# EAGLE design SNARF-Protoboard-v00 (EAGLE 5.11)
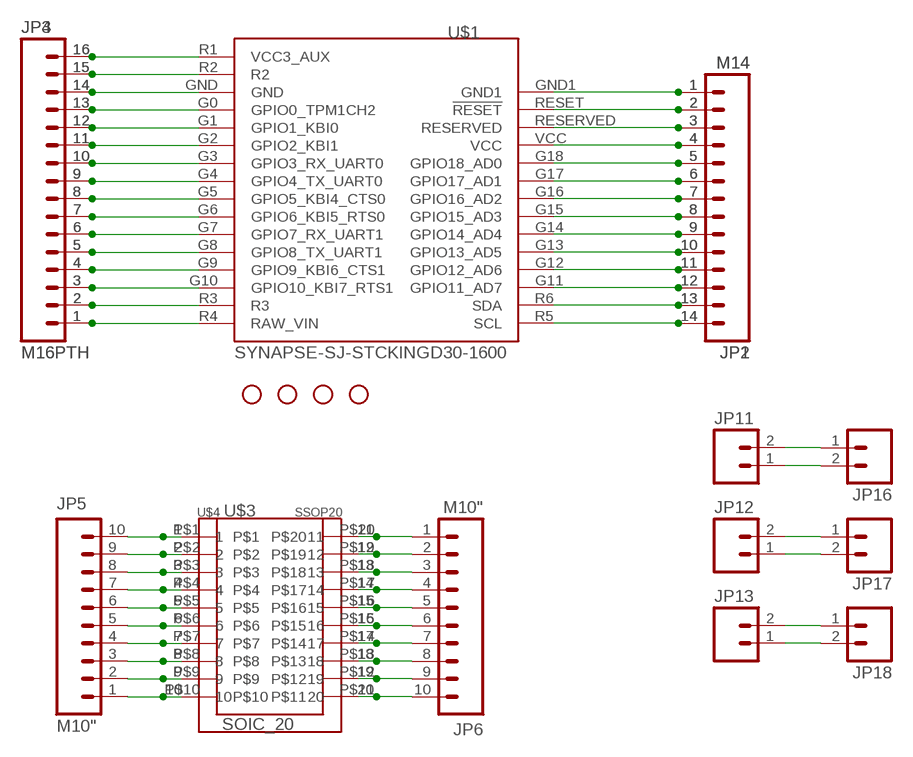
[diagram p0: schematic, sheet 1]

## Parts
JP1  M14  [1X14]
JP2  M14  [1X14]
JP3  M16PTH  [1X16]
JP4  M16PTH  [1X16]
JP5  M10"  [1X10]
JP6  M10"  [1X10]
JP7  STAND-OFF  [STAND-OFF]
JP8  STAND-OFF  [STAND-OFF]
JP9  STAND-OFF  [STAND-OFF]
JP10  STAND-OFF  [STAND-OFF]
JP11  M023.5MM  [SCREWTERMINAL-3.5MM-2]
JP12  M023.5MM  [SCREWTERMINAL-3.5MM-2]
JP13  M023.5MM  [SCREWTERMINAL-3.5MM-2]
JP16  M02PTH  [1X02]
JP17  M02PTH  [1X02]
JP18  M02PTH  [1X02]
U$1  SYNAPSE-SJ-STCKINGD30-1600  [SYNSJ-STACK]
U$3  SOIC_20  [SO20W]
U$4  SSOP20  [SSOP20-LONG]

## Nets
N$1 [bigsignal]: JP1.1 JP2.1 U$1.GND1
N$2 [bigsignal]: JP1.2 JP2.2 U$1.RESET(!RESET)
N$3 [bigsignal]: JP1.3 JP2.3 U$1.RESERVED
N$4 [bigsignal]: JP1.4 JP2.4 U$1.VCC
N$5 [bigsignal]: JP1.5 JP2.5 U$1.G18(GPIO18_AD0)
N$6 [bigsignal]: JP1.6 JP2.6 U$1.G17(GPIO17_AD1)
N$7 [bigsignal]: JP1.7 JP2.7 U$1.G16(GPIO16_AD2)
N$8 [bigsignal]: JP1.8 JP2.8 U$1.G15(GPIO15_AD3)
N$9 [bigsignal]: JP1.9 JP2.9 U$1.G14(GPIO14_AD4)
N$10 [bigsignal]: JP1.10 JP2.10 U$1.G13(GPIO13_AD5)
N$11 [bigsignal]: JP1.11 JP2.11 U$1.G12(GPIO12_AD6)
N$12 [bigsignal]: JP1.12 JP2.12 U$1.G11(GPIO11_AD7)
N$13 [bigsignal]: JP1.13 JP2.13 U$1.R6(SDA)
N$14 [bigsignal]: JP1.14 JP2.14 U$1.R5(SCL)
N$15 [bigsignal]: JP3.1 JP4.1 U$1.R4(RAW_VIN)
N$16 [bigsignal]: JP3.2 JP4.2 U$1.R3
N$17 [bigsignal]: JP3.3 JP4.3 U$1.G10(GPIO10_KBI7_RTS1)
N$18 [bigsignal]: JP3.4 JP4.4 U$1.G9(GPIO9_KBI6_CTS1)
N$19 [bigsignal]: JP3.5 JP4.5 U$1.G8(GPIO8_TX_UART1)
N$20 [bigsignal]: JP3.6 JP4.6 U$1.G7(GPIO7_RX_UART1)
N$21 [bigsignal]: JP3.7 JP4.7 U$1.G6(GPIO6_KBI5_RTS0)
N$22 [bigsignal]: JP3.8 JP4.8 U$1.G5(GPIO5_KBI4_CTS0)
N$23 [bigsignal]: JP3.9 JP4.9 U$1.G4(GPIO4_TX_UART0)
N$24 [bigsignal]: JP3.10 JP4.10 U$1.G3(GPIO3_RX_UART0)
N$25 [bigsignal]: JP3.11 JP4.11 U$1.G2(GPIO2_KBI1)
N$26 [bigsignal]: JP3.12 JP4.12 U$1.G1(GPIO1_KBI0)
N$27 [bigsignal]: JP3.13 JP4.13 U$1.G0(GPIO0_TPM1CH2)
N$28 [bigsignal]: JP3.14 JP4.14 U$1.GND
N$29 [bigsignal]: JP3.15 JP4.15 U$1.R2
N$30 [bigsignal]: JP3.16 JP4.16 U$1.R1(VCC3_AUX)
N$31: JP5.1 U$3.P$10 U$4.10
N$32: JP5.2 U$3.P$9 U$4.9
N$33: JP5.3 U$3.P$8 U$4.8
N$34: JP5.4 U$3.P$7 U$4.7
N$35: JP5.5 U$3.P$6 U$4.6
N$36: JP5.6 U$3.P$5 U$4.5
N$37: JP5.7 U$3.P$4 U$4.4
N$38: JP5.8 U$3.P$3 U$4.3
N$39: JP5.9 U$3.P$2 U$4.2
N$40: JP5.10 U$3.P$1 U$4.1
N$41: JP6.1 U$3.P$20 U$4.11
N$42: JP6.2 U$3.P$19 U$4.12
N$43: JP6.3 U$3.P$18 U$4.13
N$44: JP6.4 U$3.P$17 U$4.14
N$45: JP6.5 U$3.P$16 U$4.15
N$46: JP6.6 U$3.P$15 U$4.16
N$47: JP6.7 U$3.P$14 U$4.17
N$48: JP6.8 U$3.P$13 U$4.18
N$49: JP6.9 U$3.P$12 U$4.19
N$50: JP6.10 U$3.P$11 U$4.20
N$51: JP12.2 JP17.1
N$52: JP12.1 JP17.2
N$53: JP13.2 JP18.1
N$54: JP13.1 JP18.2
N$59: JP11.2 JP16.1
N$60: JP11.1 JP16.2

## Library data of the parts
JP1 JP2 = SparkFun:M14: Header 14 Standard 14-pin 0.1" header. Use with straight break away headers (SKU : PRT-00116), right angle break away headers (PRT-00553), swiss pins (PRT-00743), machine pins (PRT-00117), and female headers (PRT-00115).
JP3 JP4 = SparkFun:M16
JP5 JP6 = SparkFun:M10: Header 10 Standard 10-pin 0.1" header. Use with straight break away headers (SKU : PRT-00116), right angle break away headers (PRT-00553), swiss pins (PRT-00743), machine pins (PRT-00117), and female headers (PRT-00115).
JP7-JP10 = SparkFun:STAND-OFF: Stand Off This is the mechanical footprint for a #4 phillips button head screw. Use the keepout ring to avoid running the screw head into surrounding components. SKU : PRT-00447
JP11-JP13 JP16-JP18 = SparkFun:M02: Header 2 Standard 2-pin 0.1" header. Use with straight break away headers (SKU : PRT-00116), right angle break away headers (PRT-00553), swiss pins (PRT-00743), machine pins (PRT-00117), and female headers (PRT-00115). Molex polarized connector foot print use with SKU : PRT-08233 with associated crimp pins and housings.
U$1 = 0_jc-custom:SYNAPSE-SJ-STCKING: Standard layout for expansion modules using Synapse Wireless boards
U$3 = SparkFun:SOIC_20
U$4 = SparkFun:SSOP20

## Net classes
0 default: width 0.152 mm
1 bigsignal: width 0.508 mm

## Board
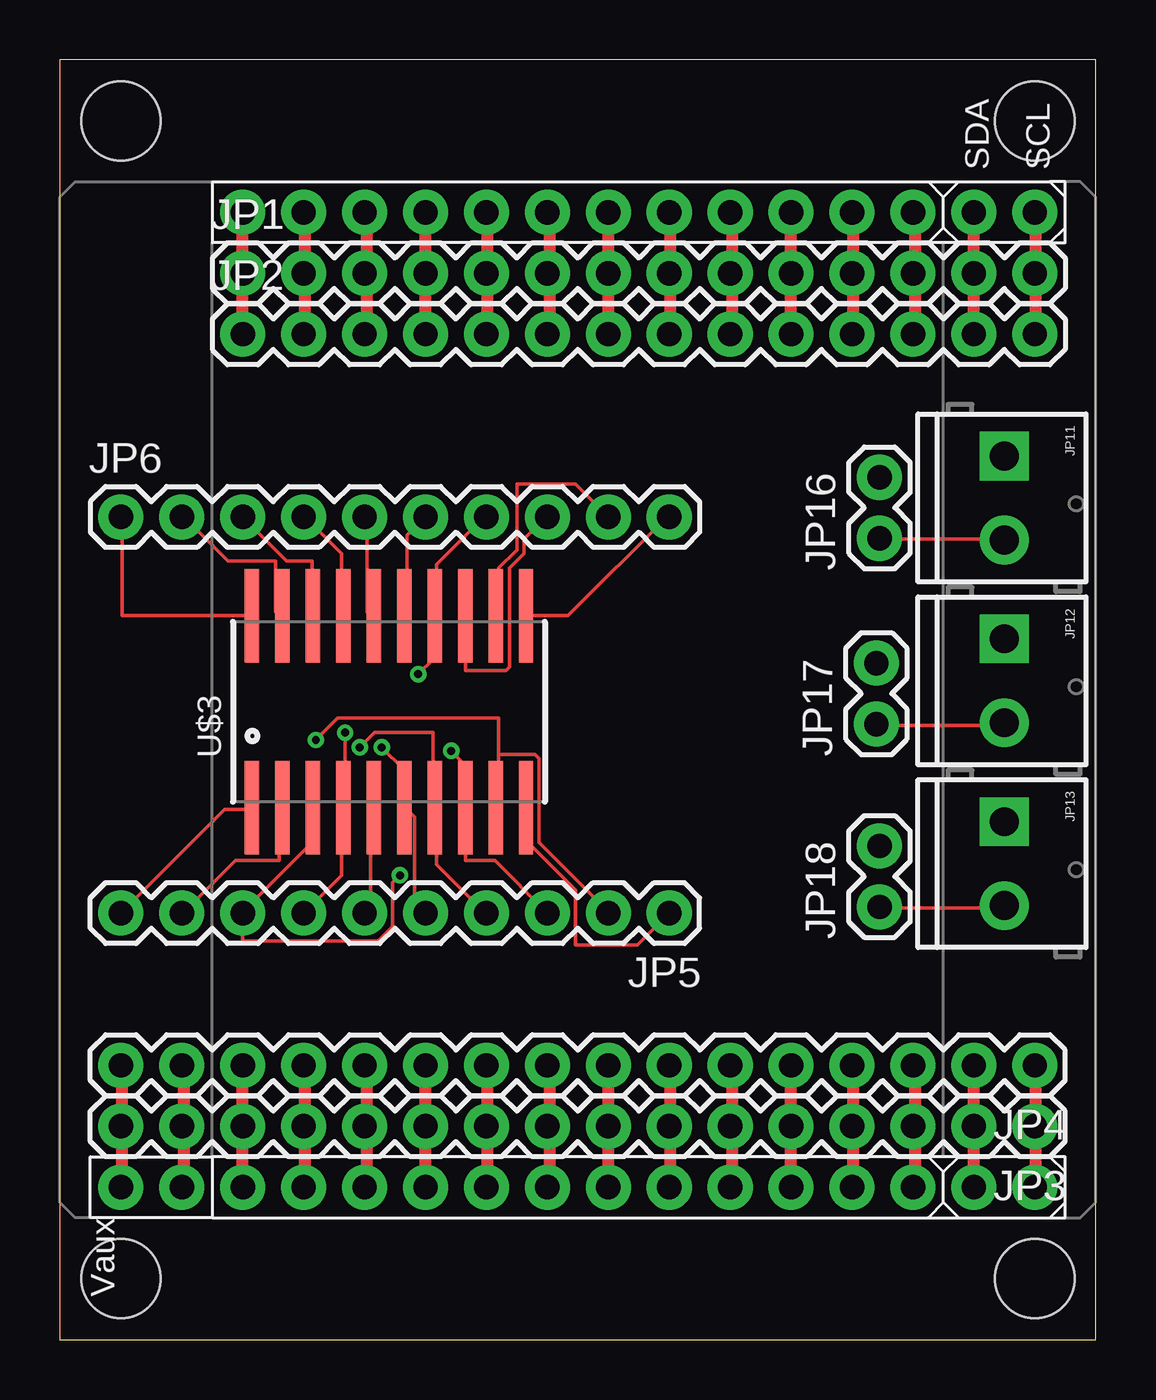
[diagram p1: board, top side]
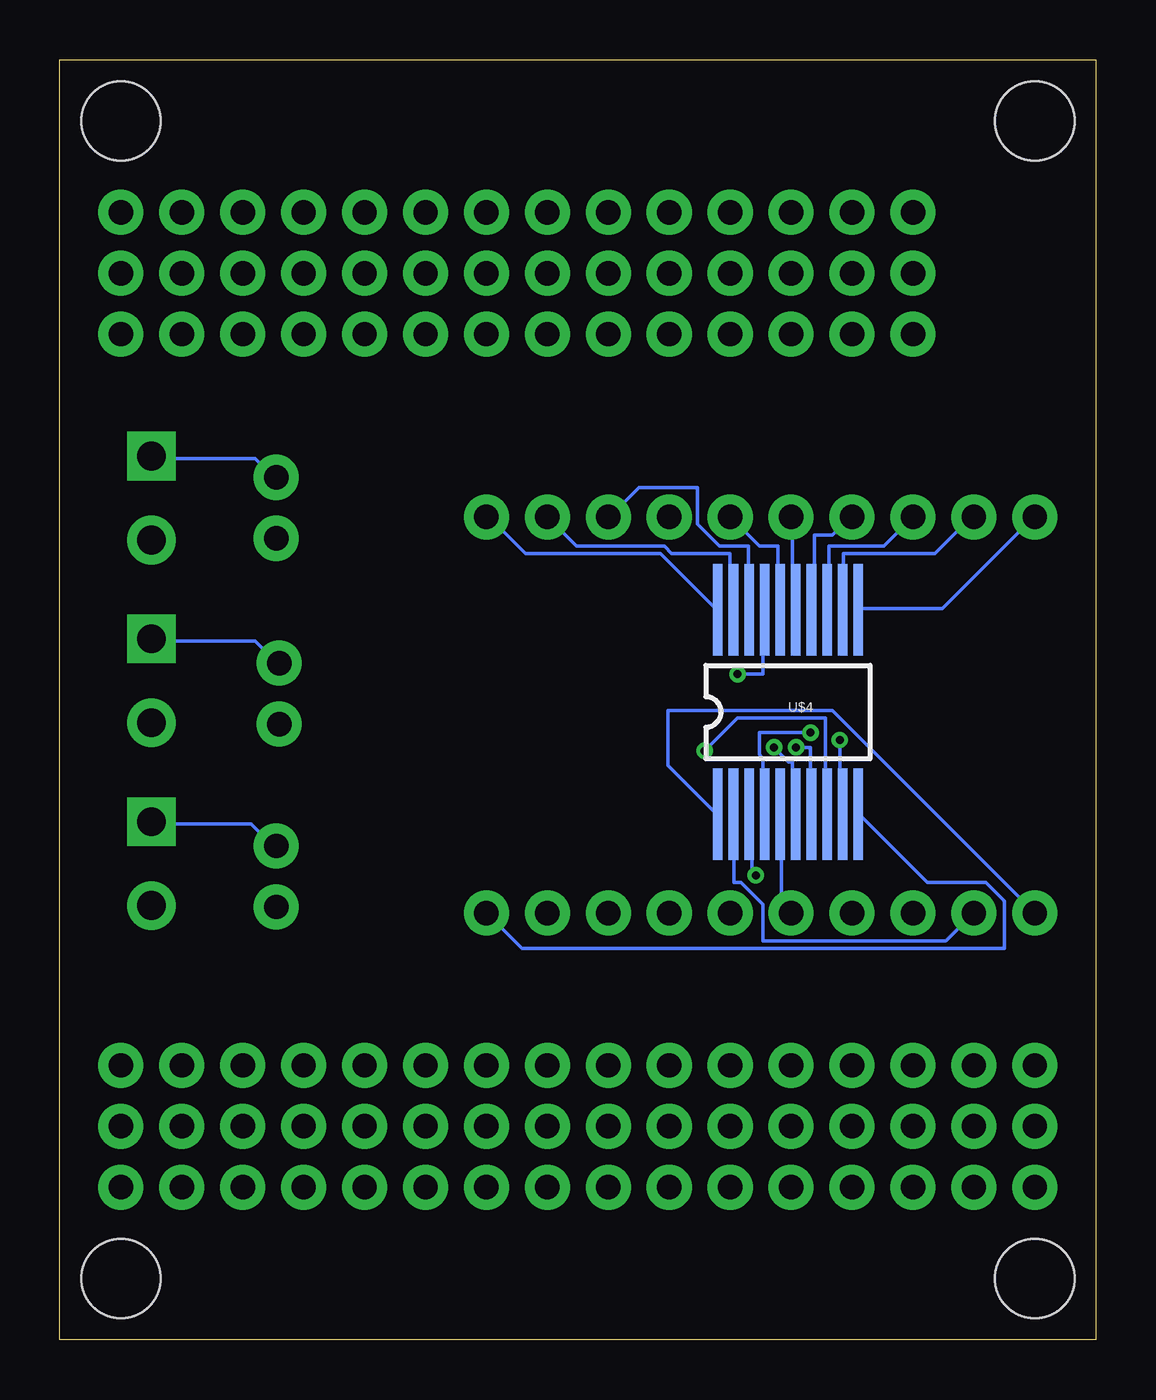
[diagram p2: board, bottom side, seen from below]

Size 43.18 x 53.34 mm. Coordinates in mm from the lower left corner, seen from the top.
Outline: 0,0 43.18,0 43.18,53.34 0,53.34 0,0
Copper layers (1*16): Top 0.0356mm / dielectric 1.5011mm / Bottom 0.0356mm
Design rules "LaenPCBOrder-JCModified": minimum track width 6mil, minimum drill 13mil, track to track 6mil, track to pad 6mil, pad to pad 6mil, via to via 6mil, smd to smd 6mil, copper to edge 15mil, drill to drill 6mil, minimum pad ring 12mil, minimum via ring 7mil, stop-mask expansion 4mil, vias tented up to drill 25mil, thermal gap 10mil

### Footprints (pad centres in the part's own frame; a part is rotated, then mirrored left to right if it is on the bottom)
1X14 = drill 1.016 pad 1.88 round: 1 0,0; 2 2.54,0; 3 5.08,0; 4 7.62,0; 5 10.16,0; 6 12.7,0; 7 15.24,0; 8 17.78,0; 9 20.32,0; 10 22.86,0; 11 25.4,0; 12 27.94,0; 13 30.48,0; 14 33.02,0
1X16 = drill 1.016 pad 1.88 round: 1 0,0; 2 2.54,0; 3 5.08,0; 4 7.62,0; 5 10.16,0; 6 12.7,0; 7 15.24,0; 8 17.78,0; 9 20.32,0; 10 22.86,0; 11 25.4,0; 12 27.94,0; 13 30.48,0; 14 33.02,0; 15 35.56,0; 16 38.1,0
1X10 = drill 1.016 pad 1.88 round: 1 0,0; 2 2.54,0; 3 5.08,0; 4 7.62,0; 5 10.16,0; 6 12.7,0; 7 15.24,0; 8 17.78,0; 9 20.32,0; 10 22.86,0
STAND-OFF = hole 3.302: 0,0
SCREWTERMINAL-3.5MM-2 = drill 1.2 pad 2.032 square: 1 0,0 | drill 1.2 pad 2.032 round: 2 3.5,0
1X02 = drill 1.016 pad 1.88 round: 1 0,0; 2 2.54,0
SYNSJ-STACK = drill 1.016 pad 1.88 round: G0 0,-7.62; G1 0,-10.16; G2 0,-12.7; G3 0,-15.24; G4 0,-17.78; G5 0,-20.32; G6 0,-22.86; G7 0,-25.4; G8 0,-27.94; G9 0,-30.48; G10 0,-33.02; G11 40.64,-33.02; G12 40.64,-30.48; G13 40.64,-27.94; G14 40.64,-25.4; G15 40.64,-22.86; G16 40.64,-20.32; G17 40.64,-17.78; G18 40.64,-15.24; GND 0,-5.08; GND1 40.64,-5.08; R1 0,0; R2 0,-2.54; R3 0,-35.56; R4 0,-38.1; R5 40.64,-38.1; R6 40.64,-35.56; RESERVED 40.64,-10.16; RESET 40.64,-7.62; VCC 40.64,-12.7
SO20W = smd 0.6 x 3.9: P$1 -5.715,-4; P$2 -4.445,-4; P$3 -3.175,-4; P$4 -1.905,-4; P$5 -0.635,-4; P$6 0.635,-4; P$7 1.905,-4; P$8 3.175,-4; P$9 4.445,-4; P$10 5.715,-4; P$11 5.715,4; P$12 4.445,4; P$13 3.175,4; P$14 1.905,4; P$15 0.635,4; P$16 -0.635,4; P$17 -1.905,4; P$18 -3.175,4; P$19 -4.445,4; P$20 -5.715,4
SSOP20-LONG = smd 0.4 x 3.81: 1 -2.925,-4.26; 2 -2.275,-4.26; 3 -1.625,-4.26; 4 -0.975,-4.26; 5 -0.325,-4.26; 6 0.325,-4.26; 7 0.975,-4.26; 8 1.625,-4.26; 9 2.275,-4.26; 10 2.925,-4.26; 11 2.925,4.26; 12 2.275,4.26; 13 1.625,4.26; 14 0.975,4.26; 15 0.325,4.26; 16 -0.325,4.26; 17 -0.975,4.26; 18 -1.625,4.26; 19 -2.275,4.26; 20 -2.925,4.26

### Placement (x,y rotation side)
JP1  7.62,44.45 0 top
JP2  7.62,41.91 0 top
JP3  40.64,8.89 180 top
JP4  40.64,11.43 180 top
JP5  25.4,17.78 180 top
JP6  2.54,34.29 0 top
JP7  2.54,2.54 0 top
JP8  40.64,2.54 0 top
JP9  2.54,50.8 0 top
JP10  40.64,50.8 0 top
JP11  39.37,36.83 270 top
JP12  39.37,29.21 270 top
JP13  39.37,21.59 270 top
JP16  34.16,33.4 90 top
JP17  34.04,25.65 90 top
JP18  34.16,18.03 90 top
U$1  2.54,6.35 90 top
U$3  13.72,26.16 0 top
U$4  12.83,26.16 0 bottom

### Tracks (layer width: path | path; a pad name or v marks a point on that pad's centre or on a via)
N$1
  Top 0.508: JP2.1 7.62,44.35 JP1.1 7.62,44.65 7.62,46.94 U$1.GND1
N$2
  Top 0.508: JP2.2 10.21,41.91 10.21,44.35 JP1.2 10.21,44.65 10.21,46.94 U$1.RESET
N$3
  Top 0.508: JP2.3 12.8,41.91 12.8,44.35 JP1.3 12.8,44.65 12.8,46.94 U$1.RESERVED
N$4
  Top 0.508: JP2.4 15.24,44.35 JP1.4 15.24,44.65 15.24,46.94 U$1.VCC
N$5
  Top 0.508: JP2.5 17.83,41.91 17.83,44.35 JP1.5 17.83,44.65 17.83,46.94 U$1.G18
N$6
  Top 0.508: JP2.6 20.42,41.91 20.42,44.35 JP1.6 20.42,44.65 20.42,46.94 U$1.G17
N$7
  Top 0.508: JP2.7 22.86,44.35 JP1.7 22.86,44.65 22.86,46.94 U$1.G16
N$8
  Top 0.508: JP2.8 25.45,41.91 25.45,44.35 JP1.8 25.45,44.65 25.45,46.94 U$1.G15
N$9
  Top 0.508: JP2.9 28.04,41.91 28.04,44.35 JP1.9 28.04,44.65 28.04,46.94 U$1.G14
N$10
  Top 0.508: JP2.10 30.48,44.35 JP1.10 30.48,44.65 30.48,46.94 U$1.G13
N$11
  Top 0.508: JP2.11 33.07,41.91 33.07,44.35 JP1.11 33.07,44.65 33.07,46.94 U$1.G12
N$12
  Top 0.508: JP2.12 35.66,41.91 35.66,44.35 JP1.12 35.66,44.65 35.66,46.94 U$1.G11
N$13
  Top 0.508: JP2.13 38.1,44.35 JP1.13 38.1,44.65 38.1,46.94 U$1.R6
N$14
  Top 0.508: JP2.14 40.69,41.91 40.69,44.35 JP1.14 40.69,44.65 40.69,46.94 U$1.R5
N$15
  Top 0.508: U$1.R4 40.69,6.4 40.69,8.84 JP3.1 40.69,8.99 40.69,11.43 JP4.1
N$16
  Top 0.508: U$1.R3 38.1,6.4 38.1,8.84 JP3.2 38.1,8.99 JP4.2
N$17
  Top 0.508: U$1.G10 35.66,6.4 35.66,8.84 JP3.3 35.66,8.99 35.66,11.43 JP4.3
N$18
  Top 0.508: U$1.G9 33.07,6.4 33.07,8.84 JP3.4 33.07,8.99 33.07,11.43 JP4.4
N$19
  Top 0.508: U$1.G8 30.48,6.4 30.48,8.84 JP3.5 30.48,8.99 JP4.5
N$20
  Top 0.508: U$1.G7 28.04,6.4 28.04,8.84 JP3.6 28.04,8.99 28.04,11.43 JP4.6
N$21
  Top 0.508: U$1.G6 25.45,6.4 25.45,8.84 JP3.7 25.45,8.99 25.45,11.43 JP4.7
N$22
  Top 0.508: U$1.G5 22.86,6.4 22.86,8.84 JP3.8 22.86,8.99 JP4.8
N$23
  Top 0.508: U$1.G4 20.42,6.4 20.42,8.84 JP3.9 20.42,8.99 20.42,11.43 JP4.9
N$24
  Top 0.508: U$1.G3 17.83,6.4 17.83,8.84 JP3.10 17.83,8.99 17.83,11.43 JP4.10
N$25
  Top 0.508: U$1.G2 15.24,6.4 15.24,8.84 JP3.11 15.24,8.99 JP4.11
N$26
  Top 0.508: U$1.G1 12.8,6.4 12.8,8.84 JP3.12 12.8,8.99 12.8,11.43 JP4.12
N$27
  Top 0.508: U$1.G0 10.21,6.4 10.21,8.84 JP3.13 10.21,8.99 10.21,11.43 JP4.13
N$28
  Top 0.508: U$1.GND 7.62,6.4 7.62,8.84 JP3.14 7.62,8.99 JP4.14
N$29
  Top 0.508: U$1.R2 5.18,6.4 5.18,8.84 JP3.15 5.18,8.99 5.18,11.43 JP4.15
N$30
  Top 0.508: U$1.R1 2.59,6.4 2.59,8.84 JP3.16 2.59,8.99 2.59,11.43 JP4.16
N$31
  Top 0.152: JP5.1 25.3,17.68 24.08,16.46 21.49,16.46 21.49,18.75 19.51,20.73 19.51,22.1 U$3.P$10
  Bottom 0.152: U$4.10 9.75,21.79 7.01,19.05 4.57,19.05 3.81,18.29 3.81,16.31 23.93,16.31 25.3,17.68 JP5.1
N$32  (via drill 0.33)
  Top 0.152: 18.29,24.38 19.81,24.38 19.96,24.23 19.96,20.73 22.86,17.83 JP5.2 | 18.29,24.38 18.29,22.25 U$3.P$9 | v10.67,24.99 11.58,25.91 18.29,25.91 18.29,24.38
  Bottom 0.152: v10.67,24.99 10.67,21.95 U$4.9
N$33  (via drill 0.33)
  Top 0.152: JP5.3 20.27,17.83 18.14,19.96 16.92,19.96 16.92,22.1 U$3.P$8 16.76,22.25 16.76,24.08 v16.31,24.54
  Bottom 0.152: v16.31,24.54 14.94,25.91 11.28,25.91 11.28,21.95 U$4.8
N$34  (via drill 0.33)
  Top 0.152: JP5.4 17.68,17.83 15.7,19.81 15.7,22.1 U$3.P$7 15.54,22.25 15.54,25.3 13.11,25.3 v12.5,24.69
  Bottom 0.152: v12.5,24.69 11.89,24.69 11.89,21.95 U$4.7
N$35  (via drill 0.33)
  Top 0.152: JP5.5 15.24,17.83 14.78,18.29 14.78,21.79 14.48,22.1 U$3.P$6 14.33,22.25 14.33,23.77 v13.41,24.69
  Bottom 0.152: v13.41,24.69 12.8,24.08 12.65,24.08 12.65,21.95 U$4.6
N$36
  Top 0.152: JP5.6 12.8,17.83 12.95,17.98 12.95,22.1 U$3.P$5
  Bottom 0.152: U$4.5 13.11,21.79 13.11,17.83 12.8,17.83 JP5.6
N$37  (via drill 0.33)
  Top 0.152: JP5.7 10.21,17.83 11.73,19.36 11.73,22.1 U$3.P$4 11.89,22.25 v11.89,25.3
  Bottom 0.152: v11.89,25.3 14.02,25.3 14.02,24.38 13.87,24.23 13.87,21.95 U$4.4
N$38  (via drill 0.33)
  Top 0.152: U$3.P$3 10.52,22.1 10.52,20.73 7.62,17.83 JP5.8 7.62,17.68 7.62,16.61 13.26,16.61 13.87,17.22 13.87,19.05 v14.17,19.36
  Bottom 0.152: v14.17,19.36 14.33,19.36 14.33,21.79 U$4.3
N$39
  Top 0.152: JP5.9 5.18,17.83 7.32,19.96 9.14,19.96 9.14,22.1 U$3.P$2
  Bottom 0.152: U$4.2 15.09,21.79 15.09,19.05 14.78,19.05 13.87,18.14 13.87,16.61 6.25,16.61 5.18,17.68 JP5.9
N$40
  Top 0.152: JP5.10 2.59,17.83 6.86,22.1 7.92,22.1 U$3.P$1
  Bottom 0.152: U$4.1 15.85,21.95 17.83,23.93 17.83,26.21 10.97,26.21 2.59,17.83 JP5.10
N$41
  Top 0.152: U$3.P$20 7.92,30.18 2.59,30.18 2.59,34.29 JP6.1
  Bottom 0.152: JP6.1 2.59,34.29 6.4,30.48 9.75,30.48 U$4.11
N$42
  Top 0.152: JP6.2 5.18,34.29 7.01,32.46 8.99,32.46 8.99,30.33 9.14,30.18 U$3.P$19
  Bottom 0.152: U$4.12 10.52,30.48 10.52,32.77 6.71,32.77 5.18,34.29 JP6.2
N$43
  Top 0.152: JP6.3 9.45,32.46 10.52,32.46 10.52,30.18 U$3.P$18
  Bottom 0.152: JP6.3 8.84,33.07 11.12,33.07 11.12,30.48 U$4.13
N$44
  Top 0.152: JP6.4 10.21,34.29 11.73,32.77 11.73,30.18 U$3.P$17
  Bottom 0.152: U$4.14 11.73,30.48 11.73,33.53 10.97,33.53 10.21,34.29 JP6.4
N$45
  Top 0.152: U$3.P$16 12.95,30.18 12.8,30.33 12.8,34.29 JP6.5
  Bottom 0.152: JP6.5 12.65,34.29 12.65,30.48 U$4.15
N$46
  Top 0.152: JP6.6 14.48,33.53 14.48,30.18 U$3.P$15
  Bottom 0.152: JP6.6 14.02,33.07 13.26,33.07 13.26,30.48 U$4.16
N$47  (via drill 0.33)
  Top 0.152: JP6.7 17.68,34.29 15.7,32.31 15.7,30.18 U$3.P$14 15.54,30.02 15.54,28.35 v14.94,27.74
  Bottom 0.152: v14.94,27.74 13.87,27.74 13.87,30.33 U$4.17
N$48
  Top 0.152: JP6.8 20.27,34.29 19.36,33.38 19.36,32.77 18.75,32.16 18.75,28.04 18.59,27.89 16.92,27.89 16.92,30.02 U$3.P$13
  Bottom 0.152: U$4.18 14.48,30.48 14.48,33.07 15.7,33.07 16.61,33.98 16.61,35.51 19.05,35.51 20.27,34.29 JP6.8
N$49
  Top 0.152: JP6.9 21.49,35.66 19.05,35.66 19.05,32.92 18.29,32.16 18.29,30.18 U$3.P$12
  Bottom 0.152: JP6.9 21.64,33.07 17.98,33.07 17.68,32.77 15.24,32.77 15.24,30.48 U$4.19
N$50
  Top 0.152: JP6.10 25.3,34.29 21.18,30.18 19.51,30.18 U$3.P$11
  Bottom 0.152: U$4.20 15.85,30.48 18.14,32.77 23.77,32.77 25.3,34.29 JP6.10
N$51
  Top 0.152: JP17.1 34.14,25.6 39.32,25.6 JP12.2
N$52
  Bottom 0.152: JP17.2 34.14,28.19 35.05,29.11 39.32,29.11 JP12.1
N$53
  Top 0.152: JP18.1 34.29,17.98 39.32,17.98 JP13.2
N$54
  Bottom 0.152: JP18.2 34.29,20.57 35.2,21.49 39.32,21.49 JP13.1
N$59
  Top 0.152: JP16.1 34.29,33.38 39.32,33.38 JP11.2
N$60
  Bottom 0.152: JP16.2 34.29,35.97 35.05,36.73 39.32,36.73 JP11.1

### Text on the board
tPlace: SDA | SCL | Vaux